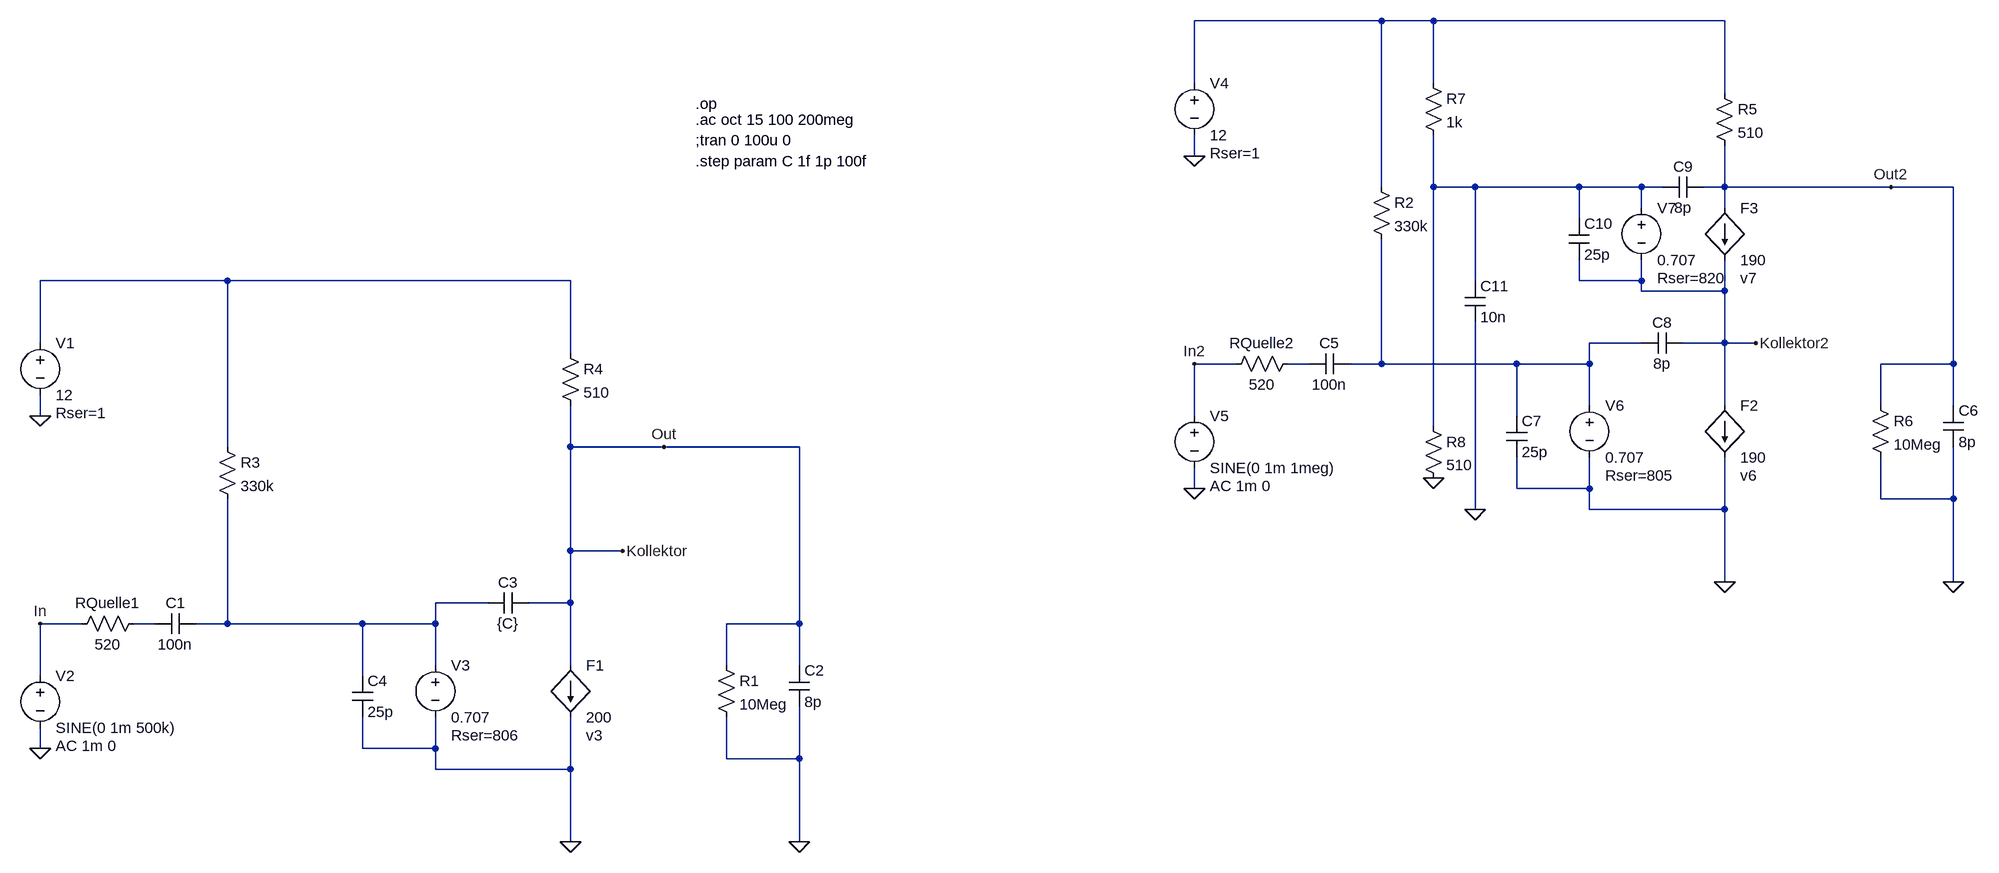
[diagram p0: schematic Draft1.asc]
Draft1.asc, the LTspice schematic file:
Version 4
SHEET 1 3080 820
WIRE 2160 -464 1872 -464
WIRE 2240 -464 2160 -464
WIRE 2688 -464 2240 -464
WIRE 1872 -368 1872 -464
WIRE 2240 -368 2240 -464
WIRE 2688 -352 2688 -464
WIRE 1872 -256 1872 -288
WIRE 2160 -208 2160 -464
WIRE 2240 -208 2240 -288
WIRE 2304 -208 2240 -208
WIRE 2464 -208 2304 -208
WIRE 2560 -208 2464 -208
WIRE 2592 -208 2560 -208
WIRE 2688 -208 2688 -272
WIRE 2688 -208 2656 -208
WIRE 2944 -208 2688 -208
WIRE 3040 -208 2944 -208
WIRE 2560 -176 2560 -208
WIRE 2688 -176 2688 -208
WIRE 2464 -160 2464 -208
WIRE 384 -64 96 -64
WIRE 912 -64 384 -64
WIRE 2304 -64 2304 -208
WIRE 2464 -64 2464 -96
WIRE 2560 -64 2560 -96
WIRE 2560 -64 2464 -64
WIRE 2560 -48 2560 -64
WIRE 2688 -48 2688 -96
WIRE 2688 -48 2560 -48
WIRE 96 32 96 -64
WIRE 2560 32 2480 32
WIRE 2688 32 2688 -48
WIRE 2688 32 2624 32
WIRE 2736 32 2688 32
WIRE 912 48 912 -64
WIRE 1936 64 1872 64
WIRE 2048 64 2016 64
WIRE 2160 64 2160 -128
WIRE 2160 64 2112 64
WIRE 2368 64 2160 64
WIRE 2480 64 2480 32
WIRE 2480 64 2368 64
WIRE 3040 64 3040 -208
WIRE 3040 64 2928 64
WIRE 2480 128 2480 64
WIRE 2688 128 2688 32
WIRE 2928 128 2928 64
WIRE 3040 128 3040 64
WIRE 96 144 96 112
WIRE 1872 144 1872 64
WIRE 2368 144 2368 64
WIRE 2240 160 2240 -208
WIRE 384 192 384 -64
WIRE 912 192 912 128
WIRE 1056 192 912 192
WIRE 1264 192 1056 192
WIRE 1872 256 1872 224
WIRE 2368 256 2368 208
WIRE 2480 256 2480 208
WIRE 2480 256 2368 256
WIRE 2928 272 2928 208
WIRE 3040 272 3040 192
WIRE 3040 272 2928 272
WIRE 2304 288 2304 0
WIRE 2480 288 2480 256
WIRE 2688 288 2688 208
WIRE 2688 288 2480 288
WIRE 912 352 912 192
WIRE 992 352 912 352
WIRE 2688 400 2688 288
WIRE 3040 400 3040 272
WIRE 784 432 704 432
WIRE 912 432 912 352
WIRE 912 432 848 432
WIRE 160 464 96 464
WIRE 272 464 240 464
WIRE 384 464 384 272
WIRE 384 464 336 464
WIRE 592 464 384 464
WIRE 704 464 704 432
WIRE 704 464 592 464
WIRE 1264 464 1264 192
WIRE 1264 464 1152 464
WIRE 704 528 704 464
WIRE 912 528 912 432
WIRE 1152 528 1152 464
WIRE 1264 528 1264 464
WIRE 96 544 96 464
WIRE 592 544 592 464
WIRE 96 656 96 624
WIRE 592 656 592 608
WIRE 704 656 704 608
WIRE 704 656 592 656
WIRE 1152 672 1152 608
WIRE 1264 672 1264 592
WIRE 1264 672 1152 672
WIRE 704 688 704 656
WIRE 912 688 912 608
WIRE 912 688 704 688
WIRE 912 800 912 688
WIRE 1264 800 1264 672
FLAG 96 656 0
FLAG 96 144 0
FLAG 912 800 0
FLAG 1264 800 0
FLAG 96 464 In
FLAG 992 352 Kollektor
FLAG 1056 192 Out
FLAG 1872 256 0
FLAG 1872 -256 0
FLAG 2688 400 0
FLAG 3040 400 0
FLAG 1872 64 In2
FLAG 2240 240 0
FLAG 2304 288 0
FLAG 2736 32 Kollektor2
FLAG 2944 -208 Out2
SYMBOL voltage 96 16 R0
WINDOW 123 0 0 Left 0
WINDOW 39 24 124 Left 2
SYMATTR InstName V1
SYMATTR Value 12
SYMATTR SpiceLine Rser=1
SYMBOL voltage 96 528 R0
WINDOW 123 24 124 Left 2
WINDOW 39 0 0 Left 0
SYMATTR InstName V2
SYMATTR Value SINE(0 1m 500k)
SYMATTR Value2 AC 1m 0
SYMBOL voltage 704 512 R0
WINDOW 123 0 0 Left 0
WINDOW 39 24 124 Left 2
SYMATTR InstName V3
SYMATTR Value 0.707
SYMATTR SpiceLine Rser=806
SYMBOL f 912 528 R0
WINDOW 38 24 108 Left 2
SYMATTR InstName F1
SYMATTR Value 200
SYMATTR SpiceModel v3
SYMBOL cap 336 448 R90
WINDOW 0 0 32 VBottom 2
WINDOW 3 32 32 VTop 2
SYMATTR InstName C1
SYMATTR Value 100n
SYMBOL res 368 176 R0
SYMATTR InstName R3
SYMATTR Value 330k
SYMBOL res 896 32 R0
SYMATTR InstName R4
SYMATTR Value 510
SYMBOL res 1136 512 R0
SYMATTR InstName R1
SYMATTR Value 10Meg
SYMBOL cap 1248 528 R0
SYMATTR InstName C2
SYMATTR Value 8p
SYMBOL cap 576 544 R0
SYMATTR InstName C4
SYMATTR Value 25p
SYMBOL cap 848 416 R90
WINDOW 0 0 32 VBottom 2
WINDOW 3 32 32 VTop 2
SYMATTR InstName C3
SYMATTR Value {C}
SYMBOL res 256 448 R90
WINDOW 0 0 56 VBottom 2
WINDOW 3 32 56 VTop 2
SYMATTR InstName RQuelle1
SYMATTR Value 520
SYMBOL voltage 1872 -384 R0
WINDOW 123 0 0 Left 0
WINDOW 39 24 124 Left 2
SYMATTR InstName V4
SYMATTR Value 12
SYMATTR SpiceLine Rser=1
SYMBOL voltage 1872 128 R0
WINDOW 123 24 124 Left 2
WINDOW 39 0 0 Left 0
SYMATTR InstName V5
SYMATTR Value SINE(0 1m 1meg)
SYMATTR Value2 AC 1m 0
SYMBOL voltage 2480 112 R0
WINDOW 123 0 0 Left 0
WINDOW 39 24 124 Left 2
SYMATTR InstName V6
SYMATTR Value 0.707
SYMATTR SpiceLine Rser=805
SYMBOL f 2688 128 R0
WINDOW 38 24 108 Left 2
SYMATTR InstName F2
SYMATTR Value 190
SYMATTR SpiceModel v6
SYMBOL cap 2112 48 R90
WINDOW 0 0 32 VBottom 2
WINDOW 3 32 32 VTop 2
SYMATTR InstName C5
SYMATTR Value 100n
SYMBOL res 2144 -224 R0
SYMATTR InstName R2
SYMATTR Value 330k
SYMBOL res 2672 -368 R0
SYMATTR InstName R5
SYMATTR Value 510
SYMBOL res 2912 112 R0
SYMATTR InstName R6
SYMATTR Value 10Meg
SYMBOL cap 3024 128 R0
SYMATTR InstName C6
SYMATTR Value 8p
SYMBOL cap 2352 144 R0
SYMATTR InstName C7
SYMATTR Value 25p
SYMBOL cap 2624 16 R90
WINDOW 0 0 32 VBottom 2
WINDOW 3 32 32 VTop 2
SYMATTR InstName C8
SYMATTR Value 8p
SYMBOL res 2032 48 R90
WINDOW 0 0 56 VBottom 2
WINDOW 3 32 56 VTop 2
SYMATTR InstName RQuelle2
SYMATTR Value 520
SYMBOL res 2224 -384 R0
SYMATTR InstName R7
SYMATTR Value 1k
SYMBOL res 2224 144 R0
SYMATTR InstName R8
SYMATTR Value 510
SYMBOL cap 2656 -224 R90
WINDOW 0 0 32 VBottom 2
WINDOW 3 32 32 VTop 2
SYMATTR InstName C9
SYMATTR Value 8p
SYMBOL voltage 2560 -192 R0
WINDOW 123 0 0 Left 0
WINDOW 39 24 124 Left 2
SYMATTR InstName V7
SYMATTR Value 0.707
SYMATTR SpiceLine Rser=820
SYMBOL cap 2448 -160 R0
SYMATTR InstName C10
SYMATTR Value 25p
SYMBOL f 2688 -176 R0
WINDOW 38 24 108 Left 2
SYMATTR InstName F3
SYMATTR Value 190
SYMATTR SpiceModel v7
SYMBOL cap 2288 -64 R0
SYMATTR InstName C11
SYMATTR Value 10n
TEXT 1104 -336 Left 2 !.op
TEXT 1104 -312 Left 2 !.ac oct 15 100 200meg
TEXT 1104 -280 Left 2 !;tran 0 100u 0
TEXT 1104 -248 Left 2 !.step param C 1f 1p 100f

The netlist it stands for:
* Draft1.asc
V1 N003 0 12 Rser=1
V2 In 0 SINE(0 1m 500k) AC 1m 0
V3 N006 0 0.707 Rser=806
F1 Out 0 v3 200
C1 N006 N007 100n
R3 N003 N006 330k
R4 N003 Out 510
R1 Out 0 10Meg
C2 Out 0 8p
C4 N006 0 25p
C3 Out N006 {C}
RQuelle1 N007 In 520
V4 N001 0 12 Rser=1
V5 In2 0 SINE(0 1m 1meg) AC 1m 0
V6 N004 0 0.707 Rser=805
F2 Kollektor2 0 v6 190
C5 N004 N005 100n
R2 N001 N004 330k
R5 N001 Out2 510
R6 Out2 0 10Meg
C6 Out2 0 8p
C7 N004 0 25p
C8 Kollektor2 N004 8p
RQuelle2 N005 In2 520
R7 N001 N002 1k
R8 N002 0 510
C9 Out2 N002 8p
V7 N002 Kollektor2 0.707 Rser=820
C10 N002 Kollektor2 25p
F3 Out2 Kollektor2 v7 190
C11 N002 0 10n
.op
.ac oct 15 100 200meg
;tran 0 100u 0
.step param C 1f 1p 100f
.backanno
.end